# Altium project BM_Finder_Mk.I.PrjPcb
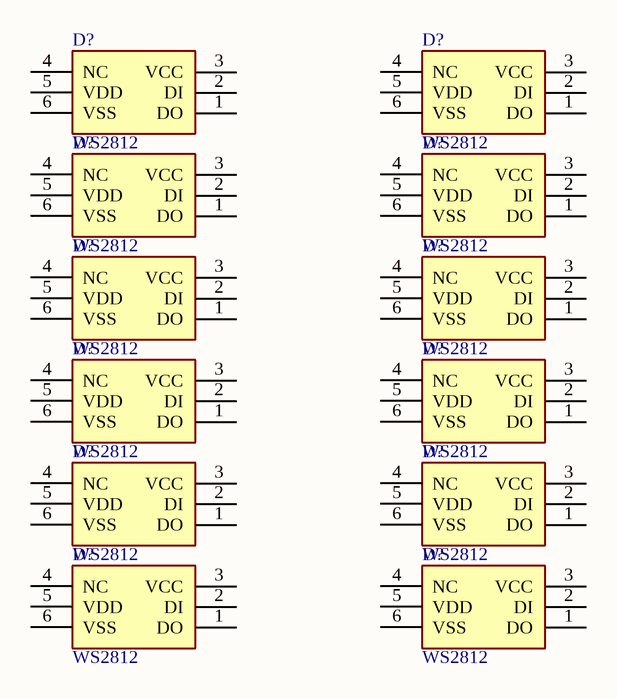
[diagram p0: BurnerFinder.SchDoc]
1 sheet, 12 parts. Net scope: global (net labels, ports and power ports of the same name join across sheets).
Board file: BurnerFinderMkI.PcbDoc

## Sheet BurnerFinder.SchDoc
size A4; SheetNumber: 1; SheetTotal: 1

### Parts
(Parts that share a designator on the sheet are numbered #1, #2 ... from top to bottom, then left to right.)
D?#1  WS2812  [WS2812]
D?#2  WS2812  [WS2812]
D?#3  WS2812  [WS2812]
D?#4  WS2812  [WS2812]
D?#5  WS2812  [WS2812]
D?#6  WS2812  [WS2812]
D?#7  WS2812  [WS2812]
D?#8  WS2812  [WS2812]
D?#9  WS2812  [WS2812]
D?#10  WS2812  [WS2812]
D?#11  WS2812  [WS2812]
D?#12  WS2812  [WS2812]

### Nets

Not connected (* = marked no-connect by the designer): D?#1 1(DO) 2(DI) 3(VCC) 4(NC) 5(VDD) 6(VSS); D?#2 1(DO) 2(DI) 3(VCC) 4(NC) 5(VDD) 6(VSS); D?#3 1(DO) 2(DI) 3(VCC) 4(NC) 5(VDD) 6(VSS); D?#4 1(DO) 2(DI) 3(VCC) 4(NC) 5(VDD) 6(VSS); D?#5 1(DO) 2(DI) 3(VCC) 4(NC) 5(VDD) 6(VSS); D?#6 1(DO) 2(DI) 3(VCC) 4(NC) 5(VDD) 6(VSS); D?#7 1(DO) 2(DI) 3(VCC) 4(NC) 5(VDD) 6(VSS); D?#8 1(DO) 2(DI) 3(VCC) 4(NC) 5(VDD) 6(VSS); D?#9 1(DO) 2(DI) 3(VCC) 4(NC) 5(VDD) 6(VSS); D?#10 1(DO) 2(DI) 3(VCC) 4(NC) 5(VDD) 6(VSS); D?#11 1(DO) 2(DI) 3(VCC) 4(NC) 5(VDD) 6(VSS); D?#12 1(DO) 2(DI) 3(VCC) 4(NC) 5(VDD) 6(VSS)

### Library data of the parts
D?#1-D?#12 = WS2812: Diode; Manufacturer_Name: Worldsemi; Datasheet Link: https://www.adafruit.com/datasheets/WS2812.pdf; Manufacturer_Part_Number: WS2812